# EasyEDA schematic escape-room-riddle-box-11-22_15-05-31.json
TITLE: RFID Escape Room with Arduino; REV: 1.0; Date: 2020-11-16; Sheet: 1/1; Company: IO LLAMA
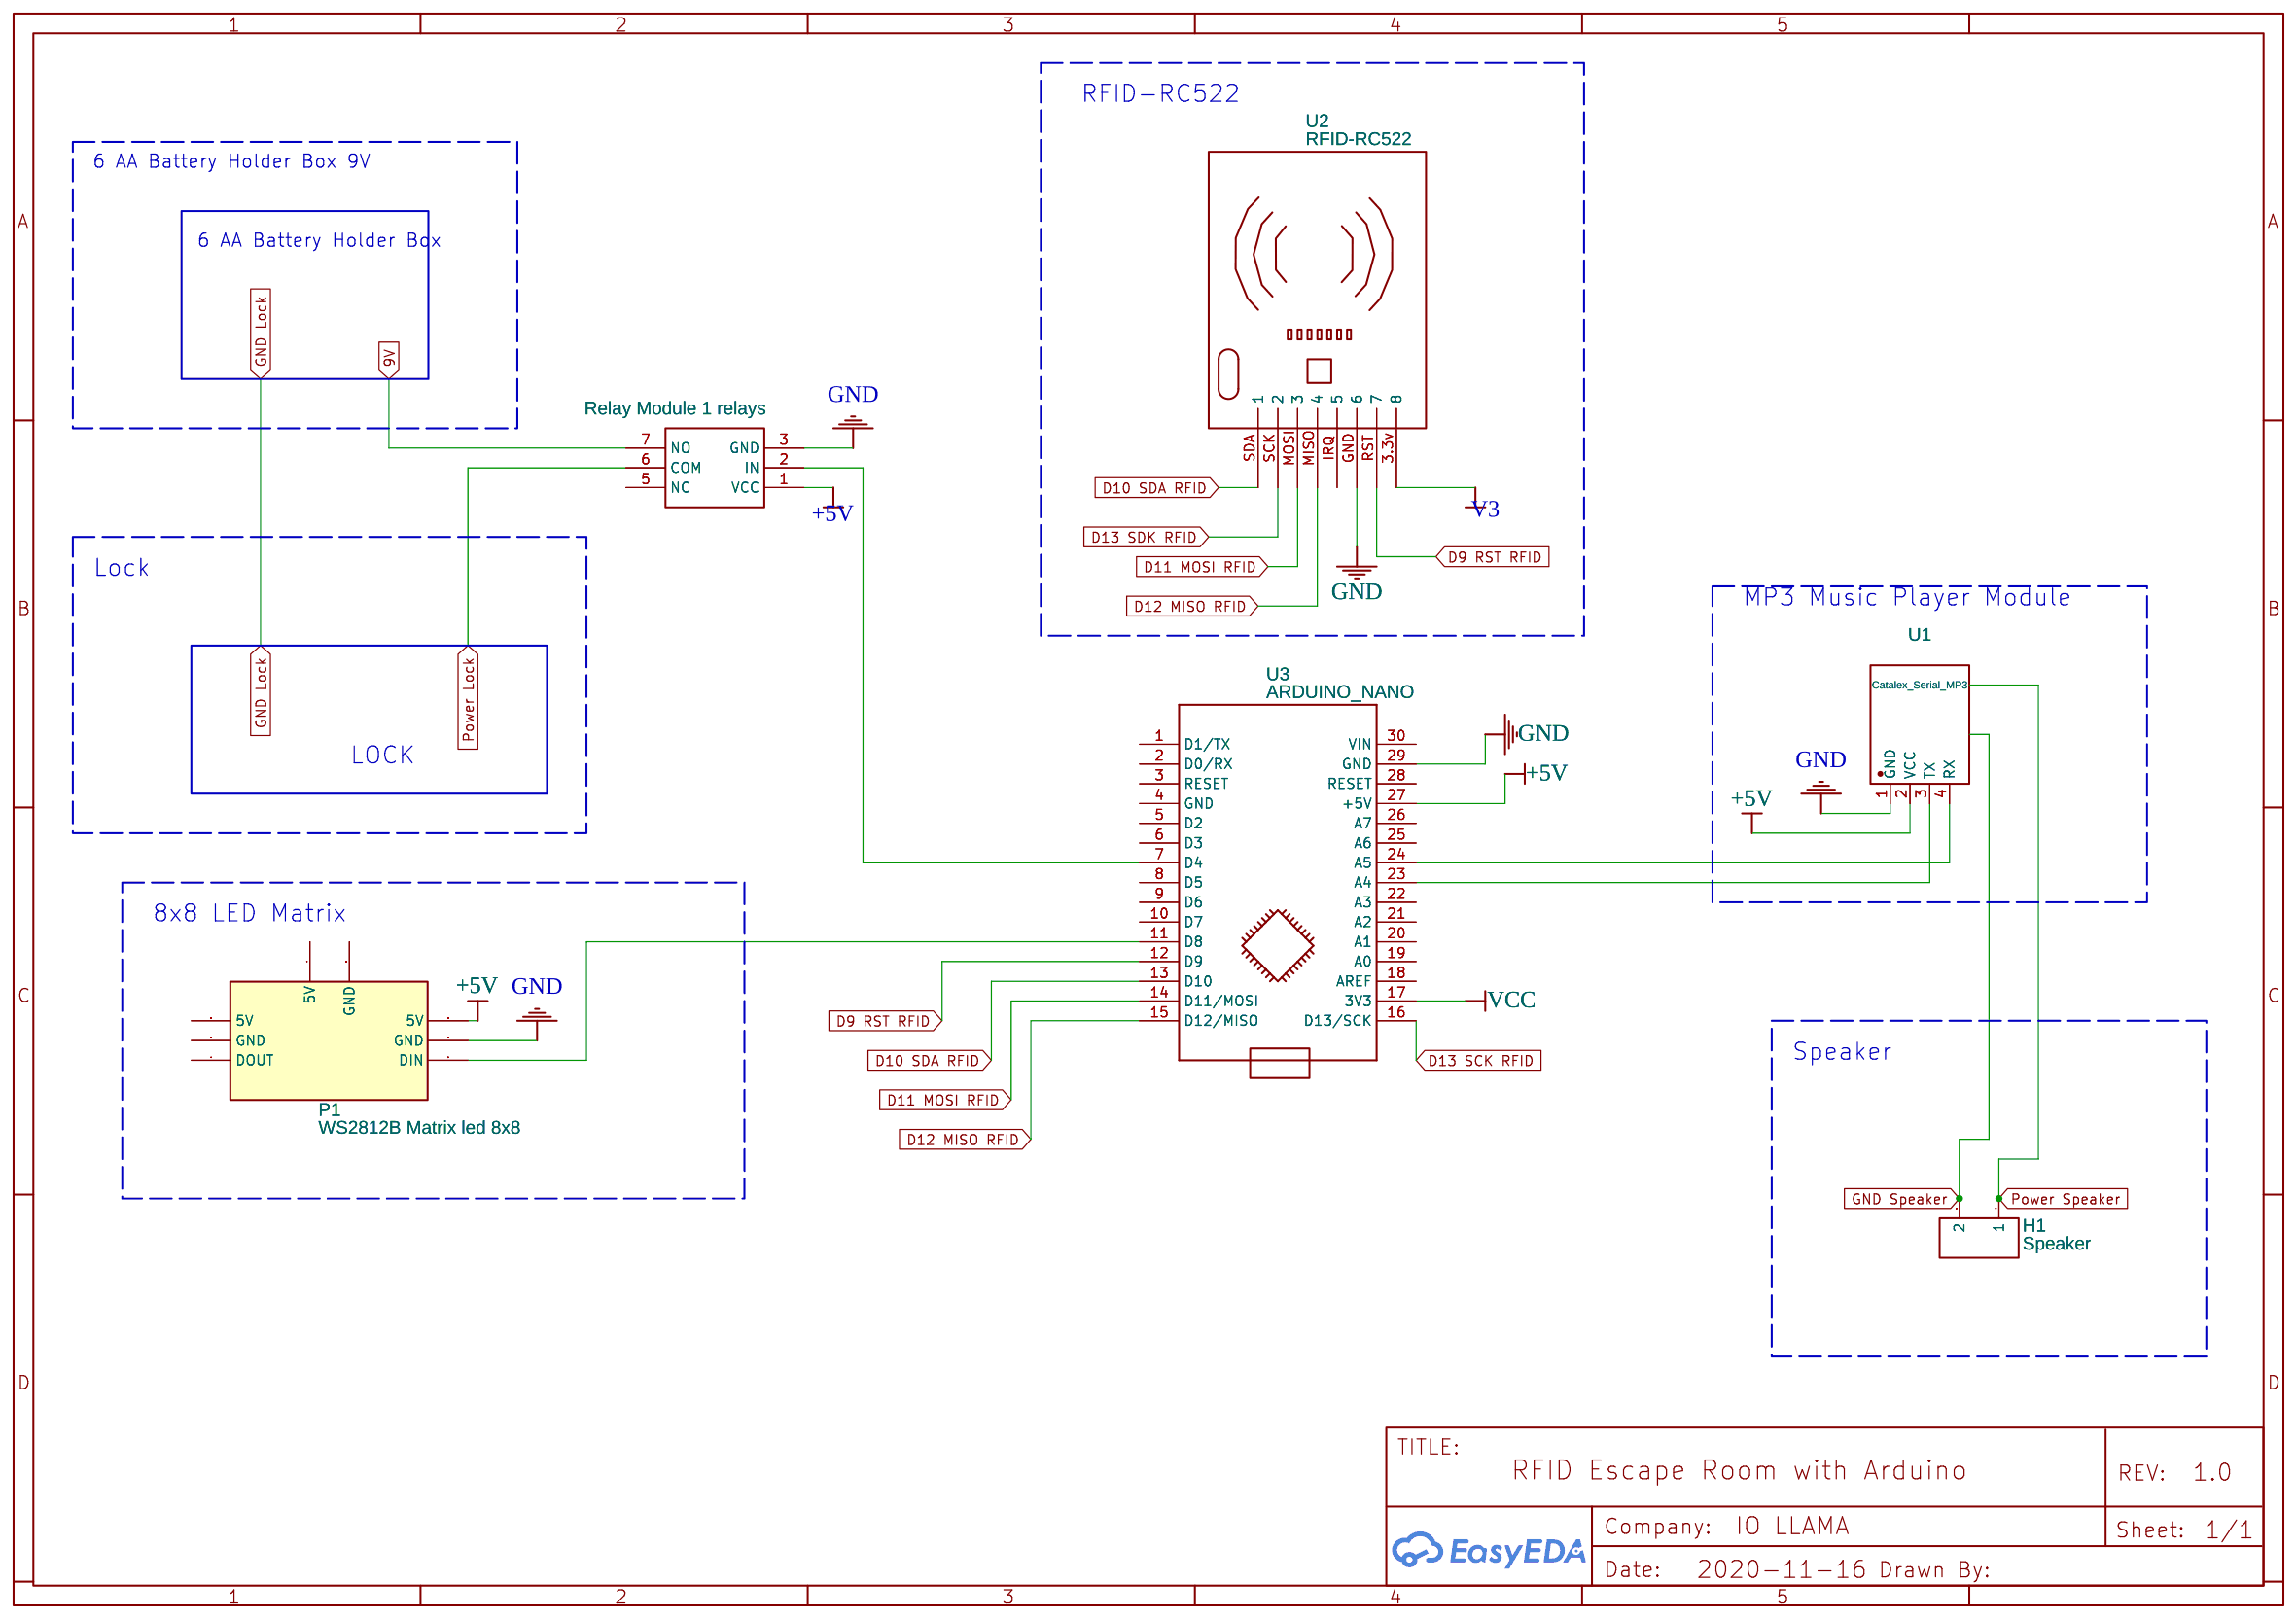
[diagram p0: schematic sheet]

## Parts
H1  Speaker  [HDR-TH_2P-P2.54-V]
P1  WS2812B Matrix led 8x8  [WS2812B]
U1  Catalex_Serial_MP3  [CATALEX_SERIAL_MP3_PINS]
U2  RFID-RC522
U3  ARDUINO_NANO  [ARDUINO_NANO]
U4  Relay Module 1 relays

## Library data of the parts
H1 = Header-Male-2.54_1x2: Supplier: LCSC; Manufacturer: TE Connectivity; Manufacturer Part: 826629-2; image: //image.lceda.cn/szlcsc/C86471.jpg; Supplier Part: C86471; Contributor: SmartPrototype
P1 = WS2812B Matrix led 8x8: sourceId: 1T5FDZYC8; Contributor: Flavio Bontà
U1 = Catalex_Serial_MP3: Manufacturer Part: Catalex_Serial_MP3_Board; Contributor: davidsamuellevin; Supplier: DealsExtreme; link: http://www.dx.com/p/uart-control-serial-mp3-music-player-module-for-arduino-avr-arm-pic-blue-silver-342439#.Wut1LdPwbGI
U2 = RFID-RC522: Manufacturer: MFRC522; Manufacturer Part: NXP; Supplier: LCSC; link: https://www.nxp.com/docs/en/data-sheet/MFRC522.pdf; Contributor: dr.mr.beast
U3 = ARDUINO_NANO: sourceId: KGSeAWhDB
U4 = Relay Module 1 relays: Contributor: roman555

## Nets
9V: U4.7(NO)
+5V: P1.3(5V) U1.2(VCC) U3.27(+5V) U4.1(VCC)
GND: P1.2(GND) U1.1(GND) U2.GND(6) U3.29(GND) U4.3(GND)
GND Speaker: H1.2
V3: U2.3.3v(8)
VCC: U3.17(3V3)
D9 RST RFID: U2.RST(7) U3.12(D9)
D10 SDA RFID: U2.SDA(1) U3.13(D10)
D11 MOSI RFID: U2.MOSI(3) U3.14(D11/MOSI)
D12 MISO RFID: U2.MISO(4) U3.15(D12/MISO)
D13 SCK RFID: U3.16(D13/SCK)
D13 SDK RFID: U2.SCK(2)
Power Lock: U4.6(COM)
Power Speaker: H1.1
Net-(P1-1): P1.1(DIN) U3.11(D8)
Net-(U1-3): U1.3(TX) U3.23(A4)
Net-(U1-4): U1.4(RX) U3.24(A5)
Net-(U3-7): U3.7(D4) U4.2(IN)

Not connected (* = marked no-connect by the designer): P1 4(DOUT) 5(GND) 6(5V) 7(5V) 8(GND); U2 IRQ(5); U3 1(D1/TX) 2(D0/RX) 3(RESET) 4(GND) 5(D2) 6(D3) 8(D5) 9(D6) 10(D7) 18(AREF) 19(A0) 20(A1) 21(A2) 22(A3) 25(A6) 26(A7) 28(RESET) 30(VIN); U4 5(NC)

## Notes on the sheet
- RFID-RC522
- 6 AA Battery Holder Box 9V
- 6 AA Battery Holder Box
- Lock
- MP3 Music Player Module
- LOCK
- 8x8 LED Matrix
- Speaker
